# Altium schematic sheet 2000_Power.SchDoc
size A3; SheetNumber: 3; SheetTotal: 4
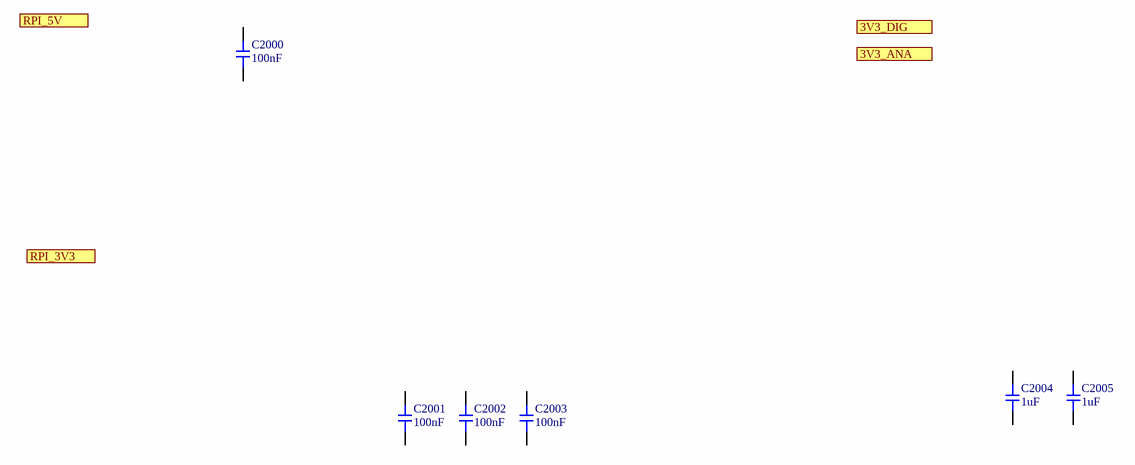
[diagram p0: 2000_Power.SchDoc]

## Parts
C2000  Capacitance: 100nF  [CAP-0603]  (hidden comment: CC0603KRX7R9BB104)
C2001  Capacitance: 100nF  [CAP-0603]  (hidden comment: CC0603KRX7R9BB104)
C2002  Capacitance: 100nF  [CAP-0603]  (hidden comment: CC0603KRX7R9BB104)
C2003  Capacitance: 100nF  [CAP-0603]  (hidden comment: CC0603KRX7R9BB104)
C2004  Capacitance: 1uF  [CAP-0603]  (hidden comment: CL10A105KB8NNNC)
C2005  Capacitance: 1uF  [CAP-0603]  (hidden comment: CL10A105KB8NNNC)

## Ports
3V3_ANA, 3V3_DIG, RPI_3V3, RPI_5V

## Nets

Not connected (* = marked no-connect by the designer): C2000 1 2; C2001 1 2; C2002 1 2; C2003 1 2; C2004 1 2; C2005 1 2

## Library data of the parts
C2000-C2003 = CC0603KRX7R9BB104: Capacitor, Ceramic (MLCC), 100nF, ±10%, 50V, X7R, ±10%, SMD 0603; Manufacturer: YAGEO; Package Size: 0603; JLCPCB Basic Part: Yes; JLCPCB Part Number: C14663; Supplier 1: LCSC; Category: Capacitors - MLCC; Supplier Part Number 1: C14663; Manufacturer Part Number: CC0603KRX7R9BB104; Tolerance: ±10%; Voltage Rating: 50V; Temperature Coefficient: X7R; RoHS: Yes; ComponentLink1Description: Datasheet; ComponentLink1URL: https://datasheet.lcsc.com/lcsc/1809301912_YAGEO-CC0603KRX7R9BB104_C14663.pdf; ComponentLink2Description: JLCPCB Part URL; ComponentLink2URL: https://jlcpcb.com/partdetail/C14663; ComponentLink3Description: LCSC Part URL; ComponentLink3URL: https://lcsc.com/product-detail/Multilayer-Ceramic-Capacitors-MLCC---SMD-SMT_YAGEO-YAGEO-CC0603KRX7R9BB104_C14663.html
C2004 C2005 = CL10A105KB8NNNC: Capacitor, Ceramic (MLCC), 1uF, ±10%, 50V, X5R, ±10%, SMD 0603; Manufacturer: Samsung Electro-Mechanics; Package Size: 0603; JLCPCB Basic Part: Yes; JLCPCB Part Number: C15849; Supplier 1: LCSC; Category: Capacitors - MLCC; Supplier Part Number 1: C15849; Manufacturer Part Number: CL10A105KB8NNNC; Tolerance: ±10%; Voltage Rating: 50V; Temperature Coefficient: X5R; RoHS: Yes; ComponentLink1Description: Datasheet; ComponentLink1URL: https://datasheet.lcsc.com/lcsc/1810261812_Samsung-Electro-Mechanics-CL10A105KB8NNNC_C15849.pdf; ComponentLink2Description: JLCPCB Part URL; ComponentLink2URL: https://jlcpcb.com/partdetail/C15849; ComponentLink3Description: LCSC Part URL; ComponentLink3URL: https://lcsc.com/product-detail/Multilayer-Ceramic-Capacitors-MLCC---SMD-SMT_Samsung-Electro-Mechanics-Samsung-Electro-Mechanics-CL10A105KB8NNNC_C15849.html